# EAGLE design vco-4069-schmitz-smt (EAGLE 7.5.0)
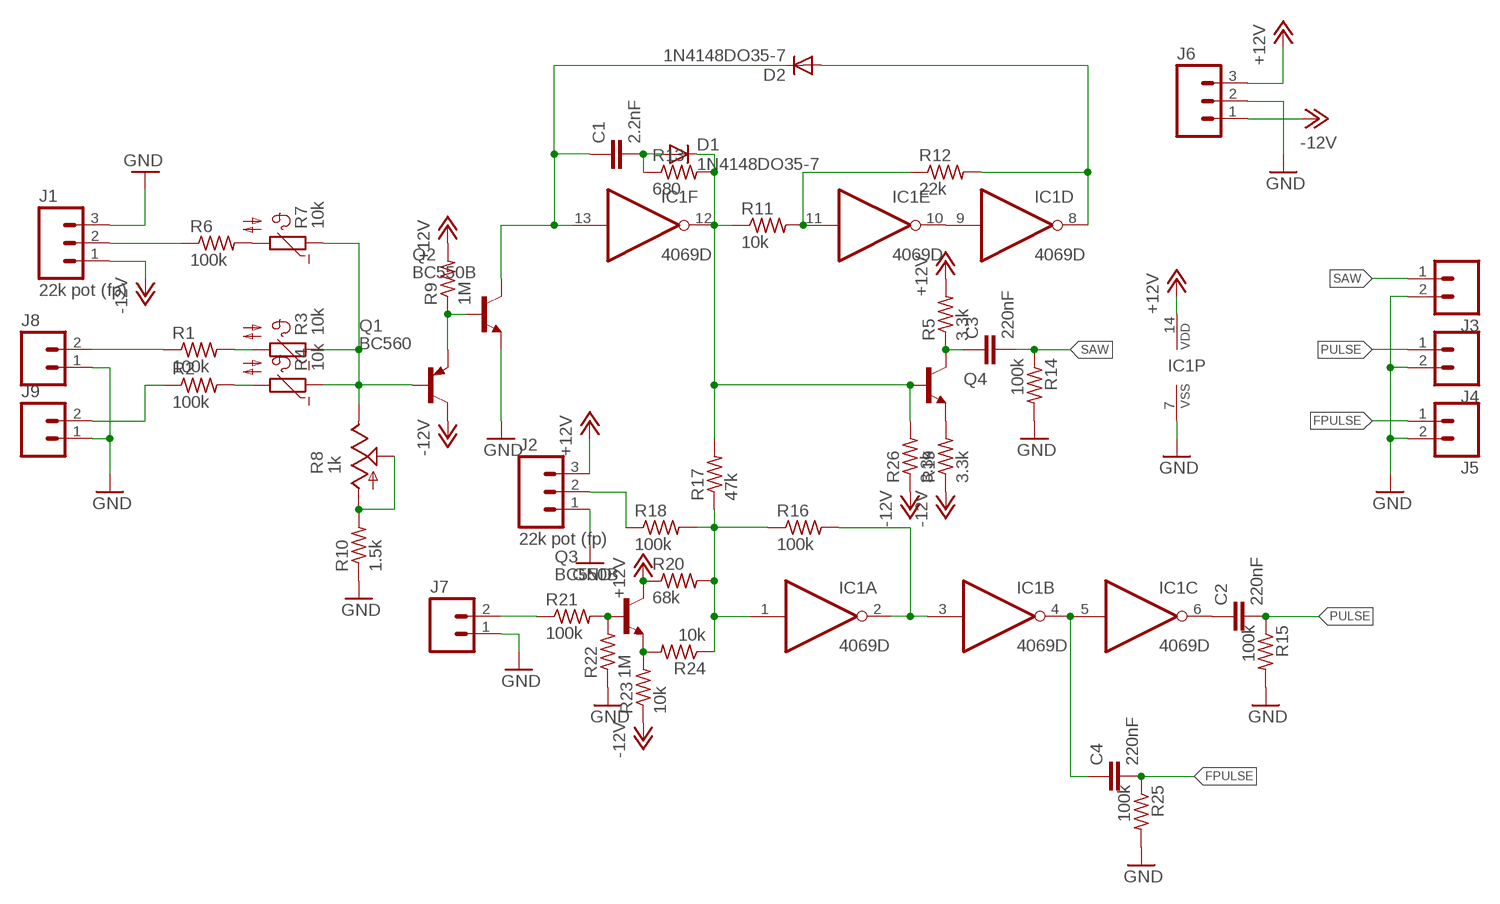
[diagram p0: schematic, sheet 1]

## Parts
C1  2.2nF  C-EUC0805  [C0805]
C2  220nF  C-EUC0805  [C0805]
C3  220nF  C-EUC0805  [C0805]
C4  220nF  C-EUC0805  [C0805]
D1  1N4148DO35-7  [DO35-7]
D2  1N4148DO35-7  [DO35-7]
IC1  4069D  [SO14]
J1  22k pot (fp)  M03PTH  [1X03]
J2  22k pot (fp)  M03PTH  [1X03]
J3  M02PTH  [1X02]
J4  M02PTH  [1X02]
J5  M02PTH  [1X02]
J6  M03PTH  [1X03]
J7  M02PTH  [1X02]
J8  M02PTH  [1X02]
J9  M02PTH  [1X02]
Q1  BC560  [TO92-EBC]
Q2  BC550B  [TO92-EBC]
Q3  BC550B  [TO92-EBC]
Q4  TRANSISTOR_NPNMMBT2222A  [SOT23-3]
R1  100k  R-US_R0805  [R0805]
R2  100k  R-US_R0805  [R0805]
R3  10k  NTC640-9  [N640]
R4  10k  NTC640-9  [N640]
R5  3.3k  R-US_R0805  [R0805]
R6  100k  R-US_R0805  [R0805]
R7  10k  NTC640-9  [N640]
R8  1k  TRIM_US-B25P  [B25P]
R9  1M  R-US_R0805  [R0805]
R10  1.5k  R-US_R0805  [R0805]
R11  10k  R-US_R0805  [R0805]
R12  22k  R-US_R0805  [R0805]
R13  680  R-US_R0805  [R0805]
R14  100k  R-US_R0805  [R0805]
R15  100k  R-US_R0805  [R0805]
R16  100k  R-US_R0805  [R0805]
R17  47k  R-US_R0805  [R0805]
R18  100k  R-US_R0805  [R0805]
R19  3.3k  R-US_R0805  [R0805]
R20  68k  R-US_R0805  [R0805]
R21  100k  R-US_R0805  [R0805]
R22  1M  R-US_R0805  [R0805]
R23  10k  R-US_R0805  [R0805]
R24  10k  R-US_R0805  [R0805]
R25  100k  R-US_R0805  [R0805]
R26  3.3k  R-US_R0805  [R0805]

## Nets
+12V: IC1.14(P:VDD) J2.3 J6.3 Q3.C R5.2 R9.2 R20.1
-12V: J1.1 J6.1 Q1.C R19.1 R23.1 R26.1
CV2: J9.2 R2.1
FPULSE: C4.2 J5.1 R25.1
GND: IC1.7(P:VSS) J1.3 J2.1 J3.2 J4.2 J5.2 J6.2 J7.1 J8.1 J9.1 Q2.E R10.1 R14.2 R15.2 R22.1 R25.2
N$1: J1.2 R6.1
N$2: R1.2 R3.2
N$3: R6.2 R7.2
N$4: R2.2 R4.2
N$5: Q3.E R23.2 R24.2
N$6: Q1.E Q2.B R9.1
N$7: R8.A R8.S R10.2
N$8: C1.1 D2.C IC1.13(F:I) Q2.C
N$9: IC1.2(A:O) IC1.3(B:I) R16.2
N$10: IC1.11(E:I) R11.2 R12.1
N$11: IC1.9(D:I) IC1.10(E:O)
N$12: D2.A IC1.8(D:O) R12.2
N$13: C1.2 D1.A R13.1
N$14: Q4.2(E) R19.2
N$15: C4.1 IC1.4(B:O) IC1.5(C:I)
N$16: C2.1 IC1.6(C:O)
N$17: IC1.1(A:I) R16.1 R17.1 R18.2 R20.2 R24.1
N$18: J2.2 R18.1
N$19: Q3.B R21.2 R22.2
N$20: Q1.B R3.1 R4.1 R7.1 R8.E
N$21: J7.2 R21.1
N$22: J8.2 R1.1
N$23: C3.1 Q4.3(C) R5.1
N$25: D1.C IC1.12(F:O) Q4.1(B) R11.1 R13.2 R17.2 R26.2
PULSE: C2.2 J4.1 R15.1
SAW: C3.2 J3.1 R14.1

## Library data of the parts
C1-C4 = resistor:C-EU: CAPACITOR, European symbol
D1 D2 = diode:1N4148: DIODE high speed (Philips)
IC1 = 40xx:4069: Hex INVERTER
J1 J2 J6 = SparkFun-Connectors:M03: Header 3 Standard 3-pin 0.1" header. Use with straight break away headers (SKU : PRT-00116), right angle break away headers (PRT-00553), swiss pins (PRT-00743), machine pins (PRT-00117), and female headers (PRT-00115). Molex polarized connector foot print use with SKU : PRT-08232 with associated crimp pins and housings.
J3-J5 J7-J9 = SparkFun-Connectors:M02: Standard 2-pin 0.1" header. Use with - straight break away headers ( PRT-00116) - right angle break away headers (PRT-00553) - swiss pins (PRT-00743) - machine pins (PRT-00117) - female headers (PRT-00115) Molex polarized connector foot print use with: PRT-08233 with associated crimp pins and housings. 2.54_SCREWTERM for use with PRT-10571. 3.5mm Screw Terminal footprints for PRT-08084 5mm Screw Terminal footprints for use with PRT-08432
Q1 = transistor-pnp:BC560*: PNP Transistror
Q2 Q3 = transistor-npn:BC550*: NPN Transistor
Q4 = SparkFun-DiscreteSemi:TRANSISTOR_NPN: Generic NPN BJT MMBT2222A - TRANS-08049 (SOT-23, 1A 40V) MPSA42 - TRANS-09116 (SOT-23, 500mA 300V) MMBT5088LT1G - TRANS-11160 (SOT-23, 50 mA 30V) BC547 - COM-08928 <http://www.sparkfun.com/products/8928> (TO-92 45V 100mA) (1.Collector 2.Base 3.Emitter) 2N3904 - COM-00521 <http://www.sparkfun.com/products/521> (TO-92 40V 200mA) (1.Emitter 2.Base 3.Collector) P2N2222A - COM-12852 <http://www.sparkfun.com/products/12852> (TO-92 40V 600mA) (1.Collector 2.Base 3.Emitter); PROD_ID: TRANS-08049; VALUE: MMBT2222A
R1 R2 R5 R6 R9-R26 = resistor:R-US_: RESISTOR, American symbol
R3 R4 R7 = ptc-ntc:NTC640-9: PHILIPS NTC; OC_FARNELL: unknown; OC_NEWARK: unknown
R8 = pot:TRIM_US-: POTENTIOMETER

## Board
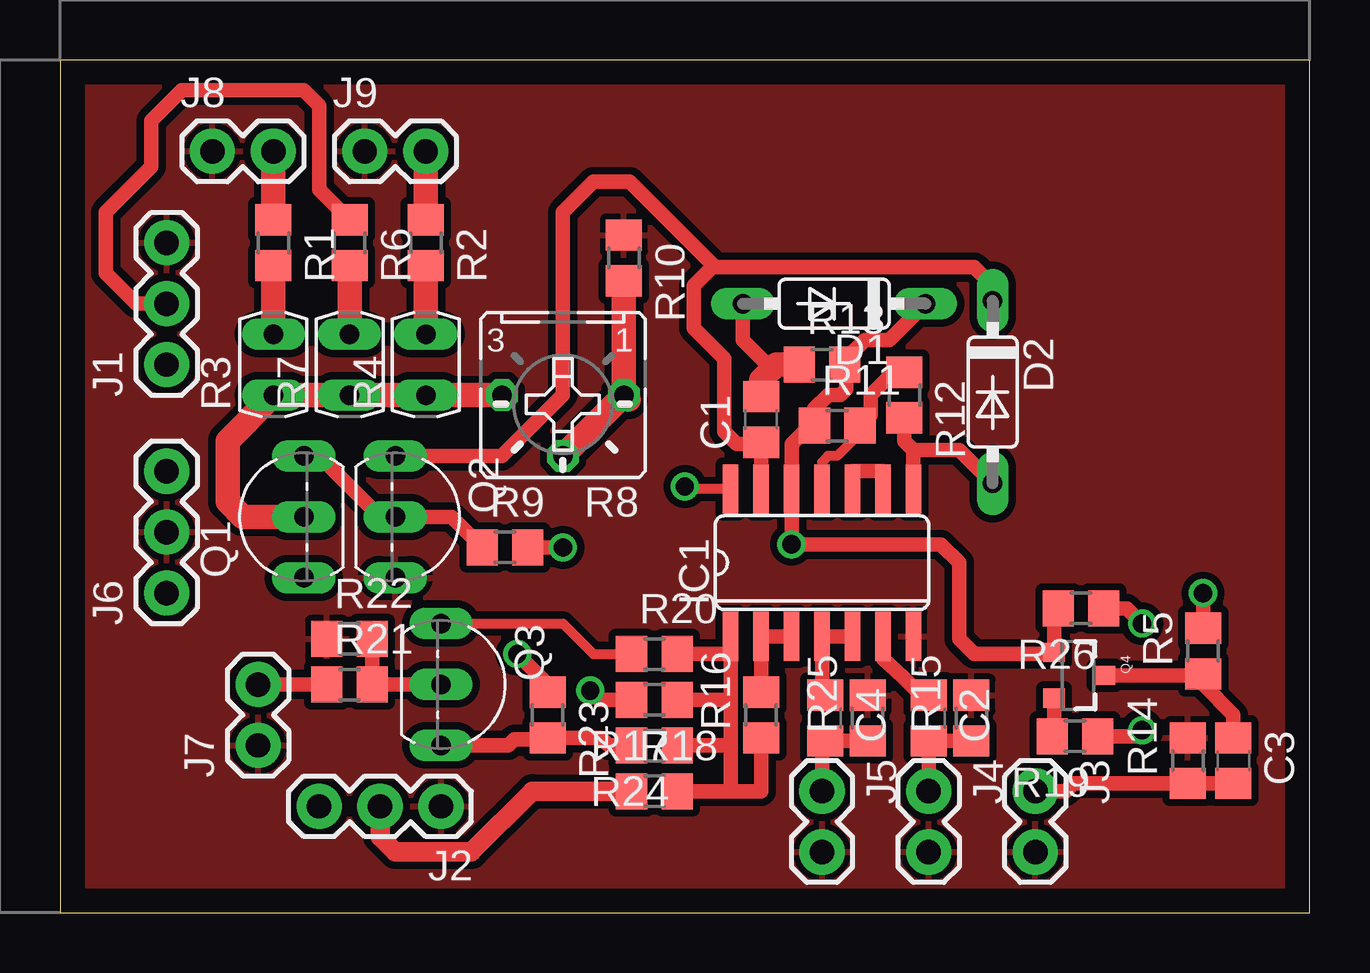
[diagram p1: board, top side]
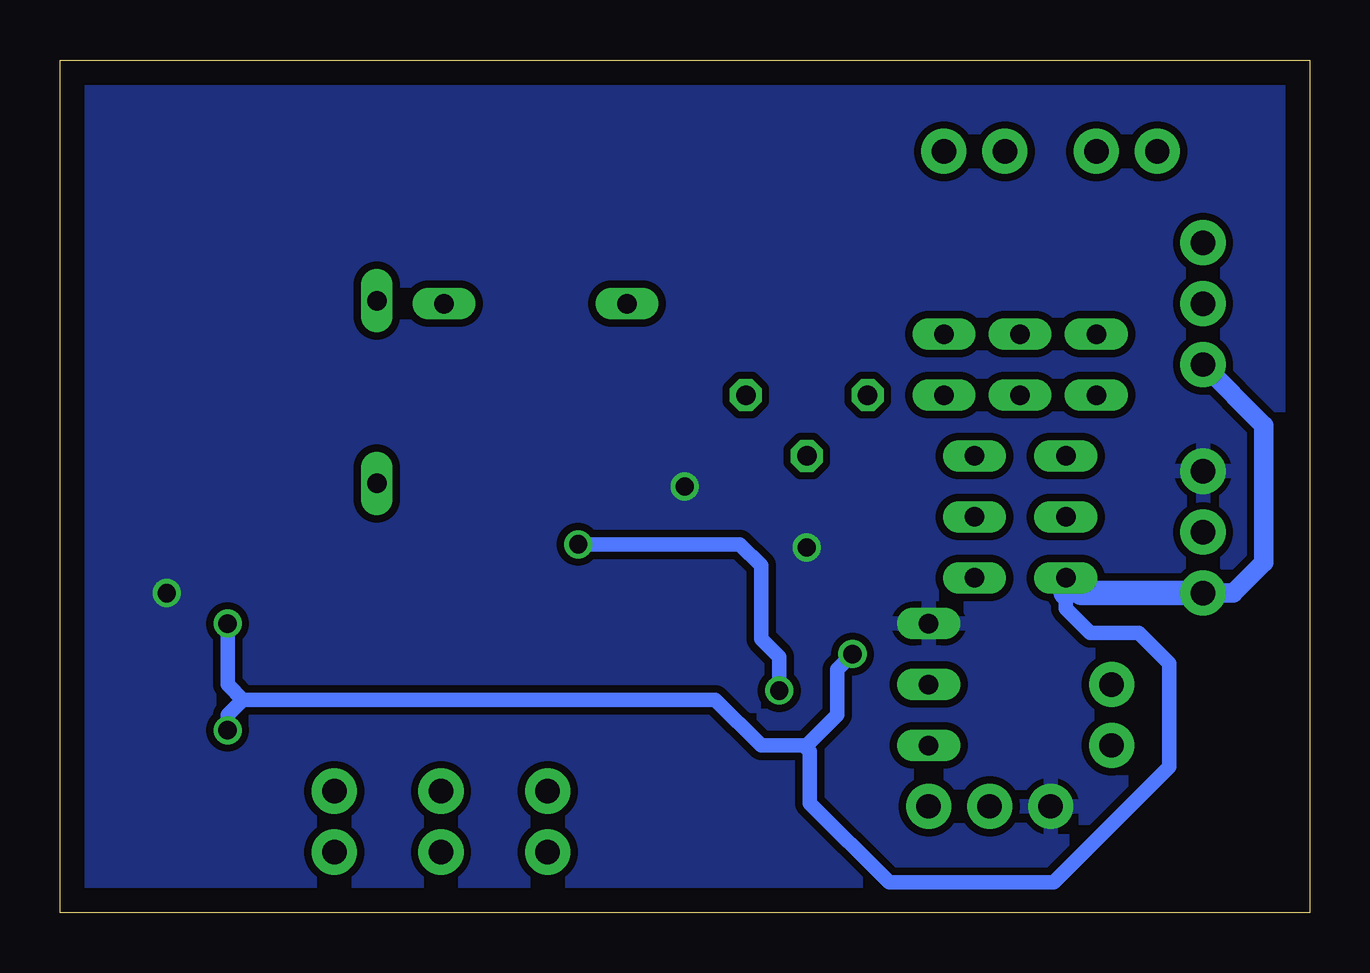
[diagram p2: board, bottom side, seen from below]

Size 52.07 x 35.56 mm. Coordinates in mm from the lower left corner, seen from the top.
Outline: 0,0 52.07,0 52.07,35.56 0,35.55 0,0
Copper layers (1*16): Top 0.035mm / dielectric 1.5mm / Bottom 0.035mm
Design rules "default": minimum track width 10mil, minimum drill 24mil, track to track 8mil, track to pad 8mil, pad to pad 8mil, via to via 8mil, smd to smd 8mil, copper to edge 40mil, drill to drill 8mil, minimum pad ring 10mil, minimum via ring 8mil, stop-mask expansion 4mil, vias tented up to drill 0mil, thermal gap 10mil

### Footprints (pad centres in the part's own frame; a part is rotated, then mirrored left to right if it is on the bottom)
C0805 = smd 1.3 x 1.5: 1 -0.95,0; 2 0.95,0
DO35-7 = drill 0.813 long: A 3.81,0; C -3.81,0
SO14 = smd 0.66 x 2.032: 1 -3.81,-3.073; 2 -2.54,-3.073; 3 -1.27,-3.073; 4 0,-3.073; 5 1.27,-3.073; 6 2.54,-3.073; 7 3.81,-3.073; 8 3.81,3.073; 9 2.54,3.073; 10 1.27,3.073; 11 0,3.073; 12 -1.27,3.073; 13 -2.54,3.073; 14 -3.81,3.073
1X03 = drill 1.016 pad 1.88: 1 0,0; 2 2.54,0; 3 5.08,0
1X02 = drill 1.016 pad 1.88: 1 0,0; 2 2.54,0
TO92-EBC = drill 0.813 long: B 0,-1.27; C -2.54,-1.27; E 2.54,-1.27
SOT23-3 = smd 0.8 x 0.9: 1 -0.95,-1; 2 0.95,-1; 3 0,1.1
R0805 = smd 1.3 x 1.5: 1 -0.95,0; 2 0.95,0
N640 = drill 0.813 long: 1 -1.27,0; 2 1.27,0
B25P = drill 0.813 octagon: A -2.54,0; E 2.54,0; S 0,2.54

### Placement (x,y rotation side)
C1  29.21,20.57 90 top
C2  36.2,8.13 270 top
C3  48.9,6.35 270 top
C4  31.88,8.13 270 top
D1  32.26,25.4 180 top
D2  38.86,21.72 270 top
IC1  31.75,14.61 0 top
J1  4.45,22.86 90 top
J2  15.88,4.45 180 top
J3  40.64,5.08 270 top
J4  36.2,5.08 270 top
J5  31.75,5.08 270 top
J6  4.45,13.34 90 top
J7  8.26,6.99 90 top
J8  6.35,31.75 0 top
J9  12.7,31.75 0 top
Q1  8.89,16.51 90 top
Q2  15.24,16.51 270 top
Q3  17.14,9.53 270 top
Q4  42.42,9.91 270 top
R1  8.89,27.94 270 top
R2  15.24,27.94 270 top
R3  8.89,22.86 90 top
R4  15.24,22.86 90 top
R5  47.62,10.92 90 top
R6  12.06,27.94 270 top
R7  12.06,22.86 90 top
R8  20.95,21.59 180 top
R9  18.54,15.24 0 top
R10  23.5,27.3 270 top
R11  32.38,20.32 0 top
R12  35.18,21.59 270 top
R13  31.75,22.86 0 top
R14  46.99,6.35 90 top
R15  37.97,8.13 90 top
R16  29.21,8.26 90 top
R17  24.77,8.89 180 top
R18  24.77,5.08 0 top
R19  42.29,7.37 180 top
R20  24.77,10.79 0 top
R21  12.06,9.53 0 top
R22  12.06,11.43 0 top
R23  20.32,8.26 270 top
R24  24.77,6.99 180 top
R25  33.66,8.13 90 top
R26  42.55,12.7 180 top

### Tracks (layer width: path | path; a pad name or v marks a point on that pad's centre or on a via)
+12V  (via drill 0.76)
  Top 0.406: Q3.C 20.95,12.06 22.23,10.79 R20.1 | IC1.14 26.14,17.68 v26.04,17.78
  Top 0.61: R9.2 v20.95,15.24 | v47.62,13.34 R5.2
  pour Bottom (isolate 0.305): -2.54,38.1 -2.54,-2.54 54.61,-2.54 54.61,38.1
-12V  (via drill 0.76)
  Top 0.61: R23.1 20.32,9.53 v19.05,10.79 | R19.1 44.83,7.37 v45.09,7.62 | R26.1 44.45,12.7 v45.09,12.06
  Bottom 0.61: v45.09,7.62 45.09,8.26 44.45,8.89 | 44.45,8.89 24.77,8.89 22.86,6.99 21.08,6.99 | 21.08,6.99 20.95,6.99 19.68,8.26 19.68,10.16 v19.05,10.79 | v45.09,12.06 45.09,9.53 44.45,8.89 | 10.16,13.34 10.16,12.7 9.14,11.68 7.11,11.68 5.84,10.41 5.84,6.1 10.67,1.27 17.53,1.27 20.83,4.57 20.83,6.73 21.08,6.99
  Bottom 0.813: J1.1 1.91,20.32 1.91,14.61 3.17,13.34 J6.1
  Bottom 1.016: J6.1 9.53,13.34 Q1.C 10.16,13.34
CV2
  Top 1.016: J9.2 R2.1
FPULSE
  Top 0.61: J5.1 31.75,7.05 C4.2 R25.1
GND
  pour Top (isolate 0.305): -5.08,40.64 -5.08,-5.08 57.15,-5.08 57.15,40.64
N$1
  Top 0.61: J1.2 3.17,25.4 1.91,26.67 1.91,29.21 3.81,31.11 3.81,33.02 5.08,34.29 10.16,34.29 10.79,33.66 10.79,30.16 R6.1
N$2
  Top 1.016: R1.2 R3.2
N$3
  Top 1.016: R6.2 R7.2
N$4
  Top 1.016: R2.2 R4.2
N$5
  Top 0.61: Q3.E 18.67,6.99 18.92,7.24 20.25,7.24 R23.2 22.54,7.3 22.86,6.99 R24.2
N$6
  Top 0.61: Q1.E 10.79,19.05 13.34,16.51 Q2.B 16.32,16.51 R9.1
N$7
  Top 1.016: R8.S R8.A | 23.69,21.4 R8.A | R10.2 R8.A
N$8
  Top 0.61: IC1.13 C1.1 29.14,19.56 28.19,19.56 27.69,20.07 27.69,23.11 26.42,24.38 26.42,26.16 27.18,26.92 27.3,26.92 | D2.C 38.86,26.16 38.1,26.92 27.3,26.92 | Q2.C 18.41,19.05 20.95,21.59 20.95,29.21 22.23,30.48 23.75,30.48 27.3,26.92
N$9
  Top 0.61: R16.2 IC1.2 IC1.3
N$10
  Top 0.406: R11.2 33.34,20 32.38,19.05 32,19.05 31.75,18.8 IC1.11
  Top 0.61: R12.1 34.73,22.54 33.78,21.59 33.78,20.77 R11.2
N$11
  Top 0.61: IC1.10 33.02,18.41 34.29,18.41 IC1.9
N$12
  Top 0.61: R12.2 35.18,19.68 35.56,19.3 | IC1.8 35.56,19.3 | 35.56,19.3 37.47,19.3 D2.A
N$13
  Top 0.61: R13.1 29.46,22.86 28.45,23.88 D1.A
  Top 1.016: R13.1 29.84,22.86 29.21,22.23 C1.2
N$14
  Top 0.61: Q4.2 41.42,7.06 R19.2
N$15
  Top 0.61: IC1.5 IC1.4 31.75,9.21 C4.1
N$16
  Top 0.61: IC1.6 34.29,10.62 35.13,9.83 35.69,9.27 36,9.27 C2.1
N$17
  Top 0.61: R16.1 29.21,5.08 27.94,5.08 | 27.94,5.08 27.94,6.99 | 27.94,6.99 27.94,8.89 | 27.94,8.89 27.94,10.79 | 27.94,10.79 IC1.1 | R20.2 27.94,10.79 | R17.1 27.94,8.89 | R24.1 27.94,6.99 | R18.2 27.94,5.08
N$18
  Top 0.813: J2.2 13.34,3.17 13.97,2.54 17.14,2.54 19.68,5.08 R18.1
N$19
  Top 0.61: Q3.B R21.2 R22.2
N$20
  Top 1.016: Q1.B 7.62,16.51 6.99,17.14 6.99,19.68 R3.1 R7.1 R4.1 R8.E
N$21
  Top 0.61: J7.2 R21.1
N$22
  Top 1.016: J8.2 R1.1
N$23
  Top 0.61: Q4.3 47.56,9.91 R5.1 47.62,9.53 48.9,8.26 C3.1
N$25  (via drill 0.76)
  Top 0.61: 31.43,20.51 30.48,19.56 IC1.12 v30.48,15.37 36.7,15.37 37.47,14.61 37.47,11.43 38.1,10.79 41.36,10.79 Q4.1 41.42,12.52 R26.2 | R11.1 31.43,20.51 | 31.43,20.51 31.43,21.02 32,21.59 32.51,21.59 32.77,21.84 32.77,22.79 | 32.77,22.79 R13.2 | 32.77,22.79 32.77,23.11 33.53,23.88 34.54,23.88 D1.C | R17.2 22.48,8.89 v22.1,9.27
  Bottom 0.61: v22.1,9.27 22.1,10.67 22.86,11.43 22.86,14.48 23.75,15.37 v30.48,15.37
PULSE
  Top 0.61: R15.1 C2.2 J4.1
SAW
  Top 0.61: C3.2 R14.1 42.23,5.4 41.91,5.08 J3.1